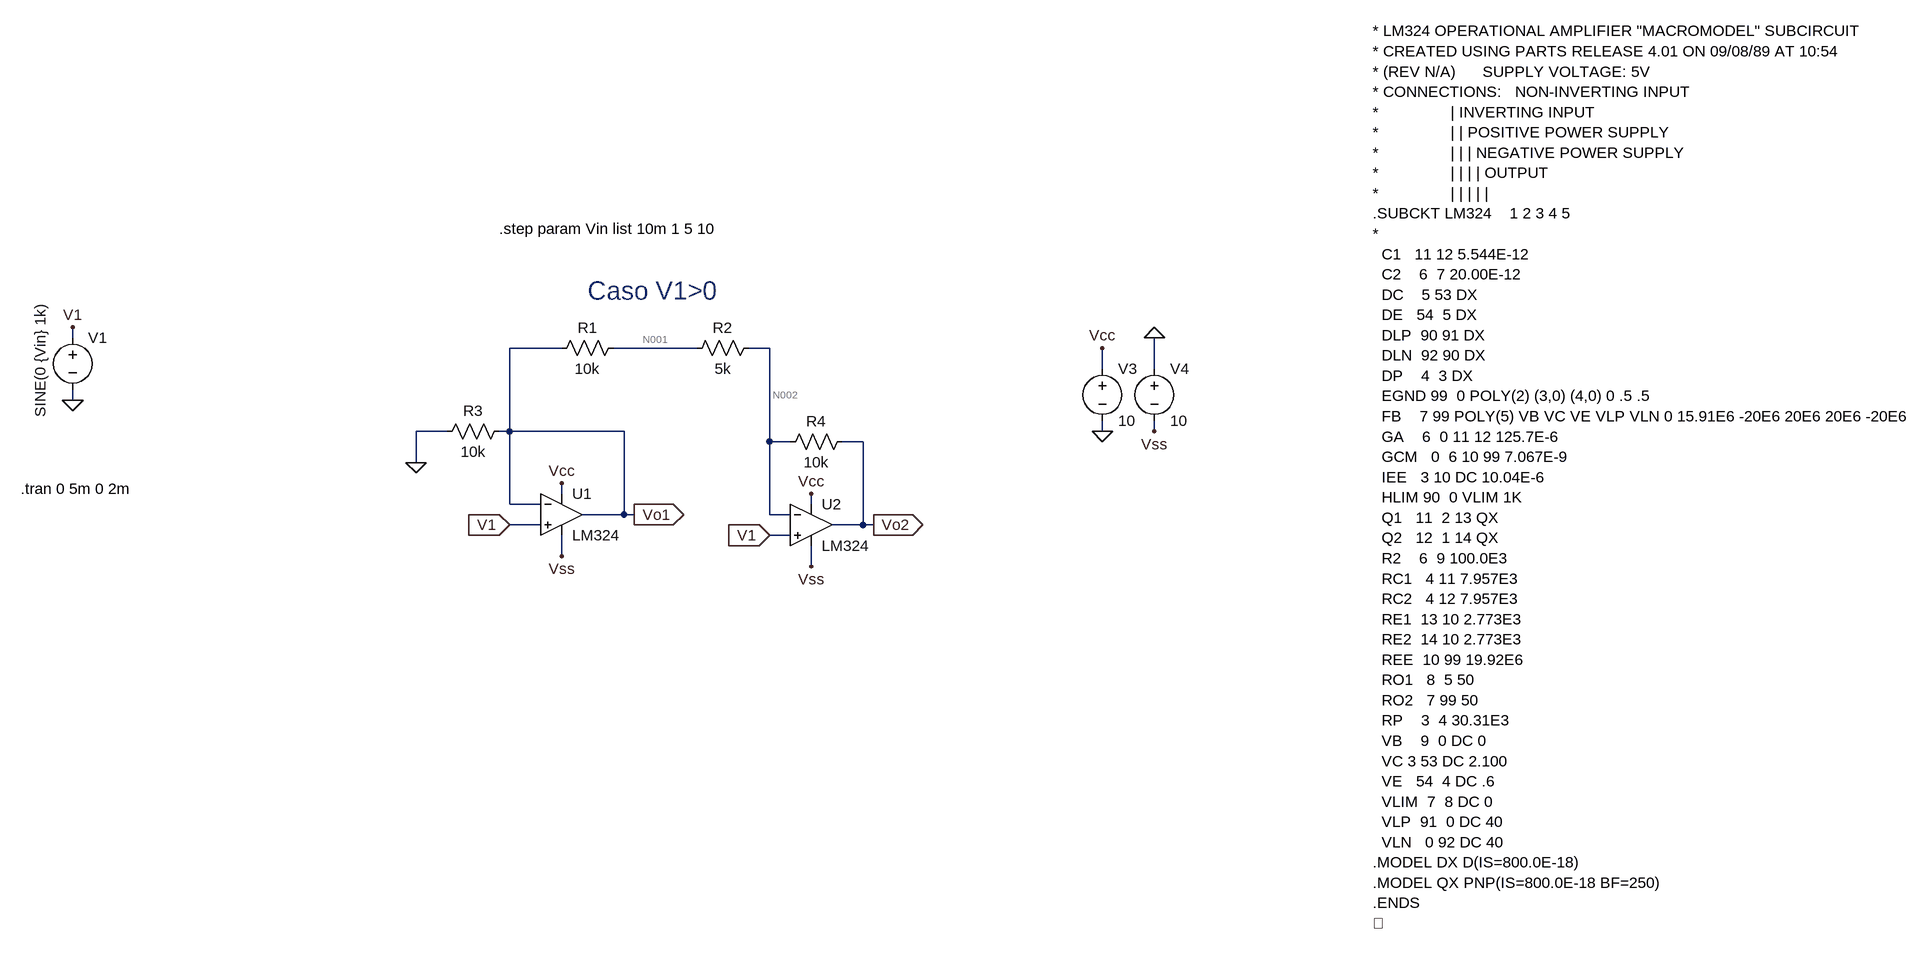
[diagram p0: schematic L1_C3_caso1.asc]
L1_C3_caso1.asc, the LTspice schematic file:
Version 4
SHEET 1 2516 10852
WIRE -656 -80 -656 -96
WIRE 96 -64 16 -64
WIRE 304 -64 176 -64
WIRE 416 -64 384 -64
WIRE 928 -32 928 -64
WIRE 1008 -32 1008 -80
WIRE -656 16 -656 0
WIRE -80 64 -128 64
WIRE 16 64 16 -64
WIRE 16 64 0 64
WIRE 192 64 16 64
WIRE 928 64 928 48
WIRE 1008 64 1008 48
WIRE 416 80 416 -64
WIRE 448 80 416 80
WIRE 560 80 528 80
WIRE -128 112 -128 64
WIRE 96 160 96 144
WIRE 16 176 16 64
WIRE 64 176 16 176
WIRE 480 176 480 160
WIRE 192 192 192 64
WIRE 192 192 128 192
WIRE 208 192 192 192
WIRE 416 192 416 80
WIRE 448 192 416 192
WIRE 64 208 16 208
WIRE 560 208 560 80
WIRE 560 208 512 208
WIRE 576 208 560 208
WIRE 448 224 416 224
WIRE 96 256 96 224
WIRE 480 272 480 240
FLAG -656 16 0
FLAG 928 64 0
FLAG 16 208 V1
IOPIN 16 208 In
FLAG -656 -96 V1
FLAG 1008 -80 0
FLAG 928 -64 Vcc
FLAG 96 144 Vcc
FLAG 480 160 Vcc
FLAG 1008 64 Vss
FLAG 480 272 Vss
FLAG 96 256 Vss
FLAG 576 208 Vo2
IOPIN 576 208 Out
FLAG -128 112 0
FLAG 208 192 Vo1
IOPIN 208 192 Out
FLAG 416 224 V1
IOPIN 416 224 In
SYMBOL res 192 -80 R90
WINDOW 0 0 56 VBottom 2
WINDOW 3 32 56 VTop 2
SYMATTR InstName R1
SYMATTR Value 10k
SYMATTR SpiceLine tol=1
SYMBOL res 400 -80 R90
WINDOW 0 0 56 VBottom 2
WINDOW 3 32 56 VTop 2
SYMATTR InstName R2
SYMATTR Value 5k
SYMATTR SpiceLine tol=1
SYMBOL res 16 48 R90
WINDOW 0 0 56 VBottom 2
WINDOW 3 32 56 VTop 2
SYMATTR InstName R3
SYMATTR Value 10k
SYMATTR SpiceLine tol=1
SYMBOL res 544 64 R90
WINDOW 0 0 56 VBottom 2
WINDOW 3 32 56 VTop 2
SYMATTR InstName R4
SYMATTR Value 10k
SYMATTR SpiceLine tol=1
SYMBOL voltage -656 -96 R0
WINDOW 123 0 0 Left 0
WINDOW 39 0 0 Left 0
WINDOW 3 -50 -37 VRight 2
SYMATTR Value SINE(0 {Vin} 1k)
SYMATTR InstName V1
SYMBOL voltage 928 -48 R0
WINDOW 123 0 0 Left 0
WINDOW 39 0 0 Left 0
SYMATTR InstName V3
SYMATTR Value 10
SYMBOL voltage 1008 -48 R0
WINDOW 123 0 0 Left 0
WINDOW 39 0 0 Left 0
SYMATTR InstName V4
SYMATTR Value 10
SYMBOL OpAmps\\opamp2 96 128 R0
SYMATTR InstName U1
SYMATTR Value LM324
SYMBOL OpAmps\\opamp2 480 144 R0
SYMATTR InstName U2
SYMATTR Value LM324
TEXT -736 152 Left 2 !.tran 0 5m 0 2m
TEXT 0 -248 Left 2 !.step param Vin list 10m 1 5 10
TEXT 1344 -552 Left 2 !* LM324 OPERATIONAL AMPLIFIER "MACROMODEL" SUBCIRCUIT\n* CREATED USING PARTS RELEASE 4.01 ON 09/08/89 AT 10:54\n* (REV N/A)      SUPPLY VOLTAGE: 5V\n* CONNECTIONS:   NON-INVERTING INPUT\n*                | INVERTING INPUT\n*                | | POSITIVE POWER SUPPLY\n*                | | | NEGATIVE POWER SUPPLY\n*                | | | | OUTPUT\n*                | | | | |\n.SUBCKT LM324    1 2 3 4 5\n*\n  C1   11 12 5.544E-12\n  C2    6  7 20.00E-12\n  DC    5 53 DX\n  DE   54  5 DX\n  DLP  90 91 DX\n  DLN  92 90 DX\n  DP    4  3 DX\n  EGND 99  0 POLY(2) (3,0) (4,0) 0 .5 .5\n  FB    7 99 POLY(5) VB VC VE VLP VLN 0 15.91E6 -20E6 20E6 20E6 -20E6\n  GA    6  0 11 12 125.7E-6\n  GCM   0  6 10 99 7.067E-9\n  IEE   3 10 DC 10.04E-6\n  HLIM 90  0 VLIM 1K\n  Q1   11  2 13 QX\n  Q2   12  1 14 QX\n  R2    6  9 100.0E3\n  RC1   4 11 7.957E3\n  RC2   4 12 7.957E3\n  RE1  13 10 2.773E3\n  RE2  14 10 2.773E3\n  REE  10 99 19.92E6\n  RO1   8  5 50\n  RO2   7 99 50\n  RP    3  4 30.31E3\n  VB    9  0 DC 0\n  VC 3 53 DC 2.100\n  VE   54  4 DC .6\n  VLIM  7  8 DC 0\n  VLP  91  0 DC 40\n  VLN   0 92 DC 40\n.MODEL DX D(IS=800.0E-18)\n.MODEL QX PNP(IS=800.0E-18 BF=250)\n.ENDS\n
TEXT 136 -152 Left 4 ;Caso V1>0

The netlist it stands for:
* L1_C3_caso1.asc
R1 N001 Vo1 10k tol=1
R2 N002 N001 5k tol=1
R3 Vo1 0 10k tol=1
R4 Vo2 N002 10k tol=1
V1 V1 0 SINE(0 {Vin} 1k)
V3 Vcc 0 10
V4 0 Vss 10
XU1 V1 Vo1 Vcc Vss Vo1 LM324  ; pins In+ In- V+ V- OUT
XU2 V1 N002 Vcc Vss Vo2 LM324  ; pins In+ In- V+ V- OUT
.tran 0 5m 0 2m
.step param Vin list 10m 1 5 10
* LM324 OPERATIONAL AMPLIFIER "MACROMODEL" SUBCIRCUIT
* CREATED USING PARTS RELEASE 4.01 ON 09/08/89 AT 10:54
* (REV N/A)      SUPPLY VOLTAGE: 5V
* CONNECTIONS:   NON-INVERTING INPUT
*                | INVERTING INPUT
*                | | POSITIVE POWER SUPPLY
*                | | | NEGATIVE POWER SUPPLY
*                | | | | OUTPUT
*                | | | | |
.SUBCKT LM324    1 2 3 4 5
*
  C1   11 12 5.544E-12
  C2    6  7 20.00E-12
  DC    5 53 DX
  DE   54  5 DX
  DLP  90 91 DX
  DLN  92 90 DX
  DP    4  3 DX
  EGND 99  0 POLY(2) (3,0) (4,0) 0 .5 .5
  FB    7 99 POLY(5) VB VC VE VLP VLN 0 15.91E6 -20E6 20E6 20E6 -20E6
  GA    6  0 11 12 125.7E-6
  GCM   0  6 10 99 7.067E-9
  IEE   3 10 DC 10.04E-6
  HLIM 90  0 VLIM 1K
  Q1   11  2 13 QX
  Q2   12  1 14 QX
  R2    6  9 100.0E3
  RC1   4 11 7.957E3
  RC2   4 12 7.957E3
  RE1  13 10 2.773E3
  RE2  14 10 2.773E3
  REE  10 99 19.92E6
  RO1   8  5 50
  RO2   7 99 50
  RP    3  4 30.31E3
  VB    9  0 DC 0
  VC 3 53 DC 2.100
  VE   54  4 DC .6
  VLIM  7  8 DC 0
  VLP  91  0 DC 40
  VLN   0 92 DC 40
.MODEL DX D(IS=800.0E-18)
.MODEL QX PNP(IS=800.0E-18 BF=250)
.ENDS

* Caso V1>0
.backanno
.end

* Results of the author's LTspice run, read from the files saved beside the schematic
* Operating Point (first step), zero values left out:
*   vin = 10 m
*   V(n001) = -33.65 µV
*   V(vo1) = -33.66 µV
*   V(n002) = -33.65 µV
*   V(vo2) = -233 µV
*   V(vcc) = 10 V
*   V(vss) = -10 V
*   I(R3) = -3.366 nA
*   I(R4) = -19.94 nA
*   I(V1) = 39.84 nA
*   I(V3) = -1.34 mA
*   I(V4) = -1.34 mA
*   Ix(u1:1) = -19.92 nA
*   Ix(u1:2) = -19.94 nA
*   Ix(u1:3) = 669.9 µA
*   Ix(u1:4) = -669.8 µA
*   Ix(u1:5) = 23.3 nA
*   Ix(u2:1) = -19.92 nA
*   Ix(u2:2) = -19.94 nA
*   Ix(u2:3) = 669.9 µA
*   Ix(u2:4) = -669.8 µA
*   Ix(u2:5) = 19.94 nA
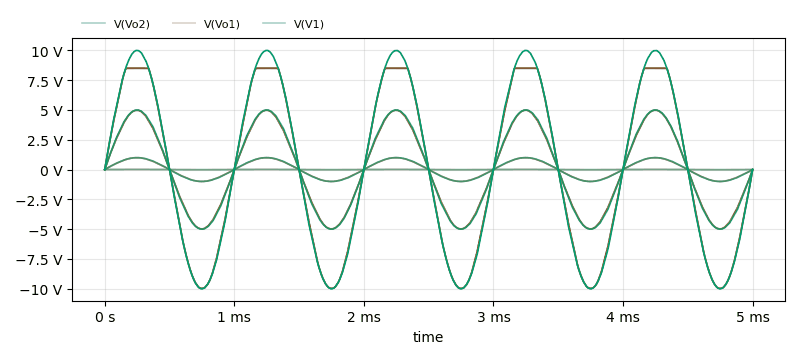
[diagram p1: Transient Analysis of L1_C3_caso1.asc, plotted from the saved traces]
* Transient Analysis, 4 runs:
*   V(Vo2) [vin=0.01]: min -10.21 mV, max 9.742 mV, average -231 µV, rms 7.035 mV, last -242.7 µV
*   V(Vo2) [vin=1]: min -995.7 mV, max 995.2 mV, average 32.8 µV, rms 700.1 mV, last -1.214 mV
*   V(Vo2) [vin=5]: min -4.982 V, max 4.982 V, average 75.5 µV, rms 3.504 V, last -5.06 mV
*   V(Vo2) [vin=10]: min -9.967 V, max 8.494 V, average -152.1 mV, rms 6.857 V, last -10.07 mV
*   V(Vo1) [vin=0.01]: min -10.01 mV, max 9.941 mV, average -31.56 µV, rms 7.031 mV, last -43.4 µV
*   V(Vo1) [vin=1]: min -995.5 mV, max 995.4 mV, average 232.2 µV, rms 700.1 mV, last -1.02 mV
*   V(Vo1) [vin=5]: min -4.982 V, max 4.982 V, average 274.9 µV, rms 3.504 V, last -4.889 mV
*   V(Vo1) [vin=10]: min -9.967 V, max 8.494 V, average -151.9 mV, rms 6.857 V, last -9.928 mV
*   V(V1) [vin=0.01]: min -10 mV, max 10 mV, average 779.2 nV, rms 7.163 mV, last 0 V
*   V(V1) [vin=1]: min -999 mV, max 999 mV, average 106.2 µV, rms 713.1 mV, last 0 V
*   V(V1) [vin=5]: min -4.998 V, max 4.999 V, average 211.6 µV, rms 3.562 V, last 0 V
*   V(V1) [vin=10]: min -10 V, max 9.996 V, average 4.679 mV, rms 7.124 V, last 0 V